# Altium schematic sheet SignalSeries.schdoc
size 508 x 304 mm
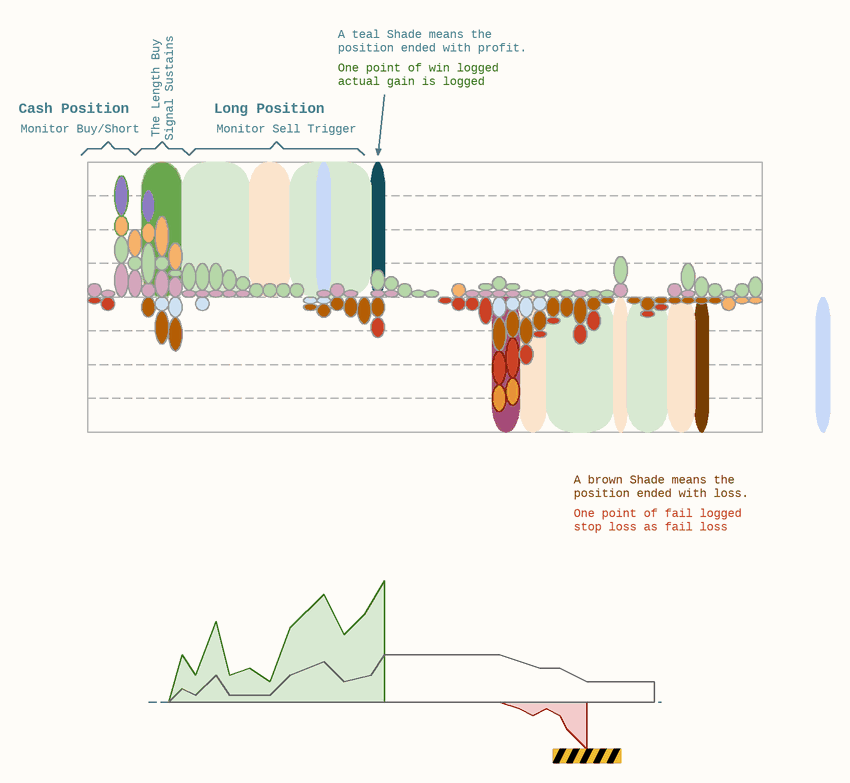
[diagram p0: SignalSeries.schdoc]

## Notes on the sheet
- A teal Shade means the
- position ended with profit.
- Cash Position
- The Length Buy
- Signal Sustains
- Long Position
- One point of win logged
- actual gain is logged
- Monitor Buy/Short
- Monitor Sell Trigger
- A brown Shade means the
- position ended with loss.
- One point of fail logged
- stop loss as fail loss